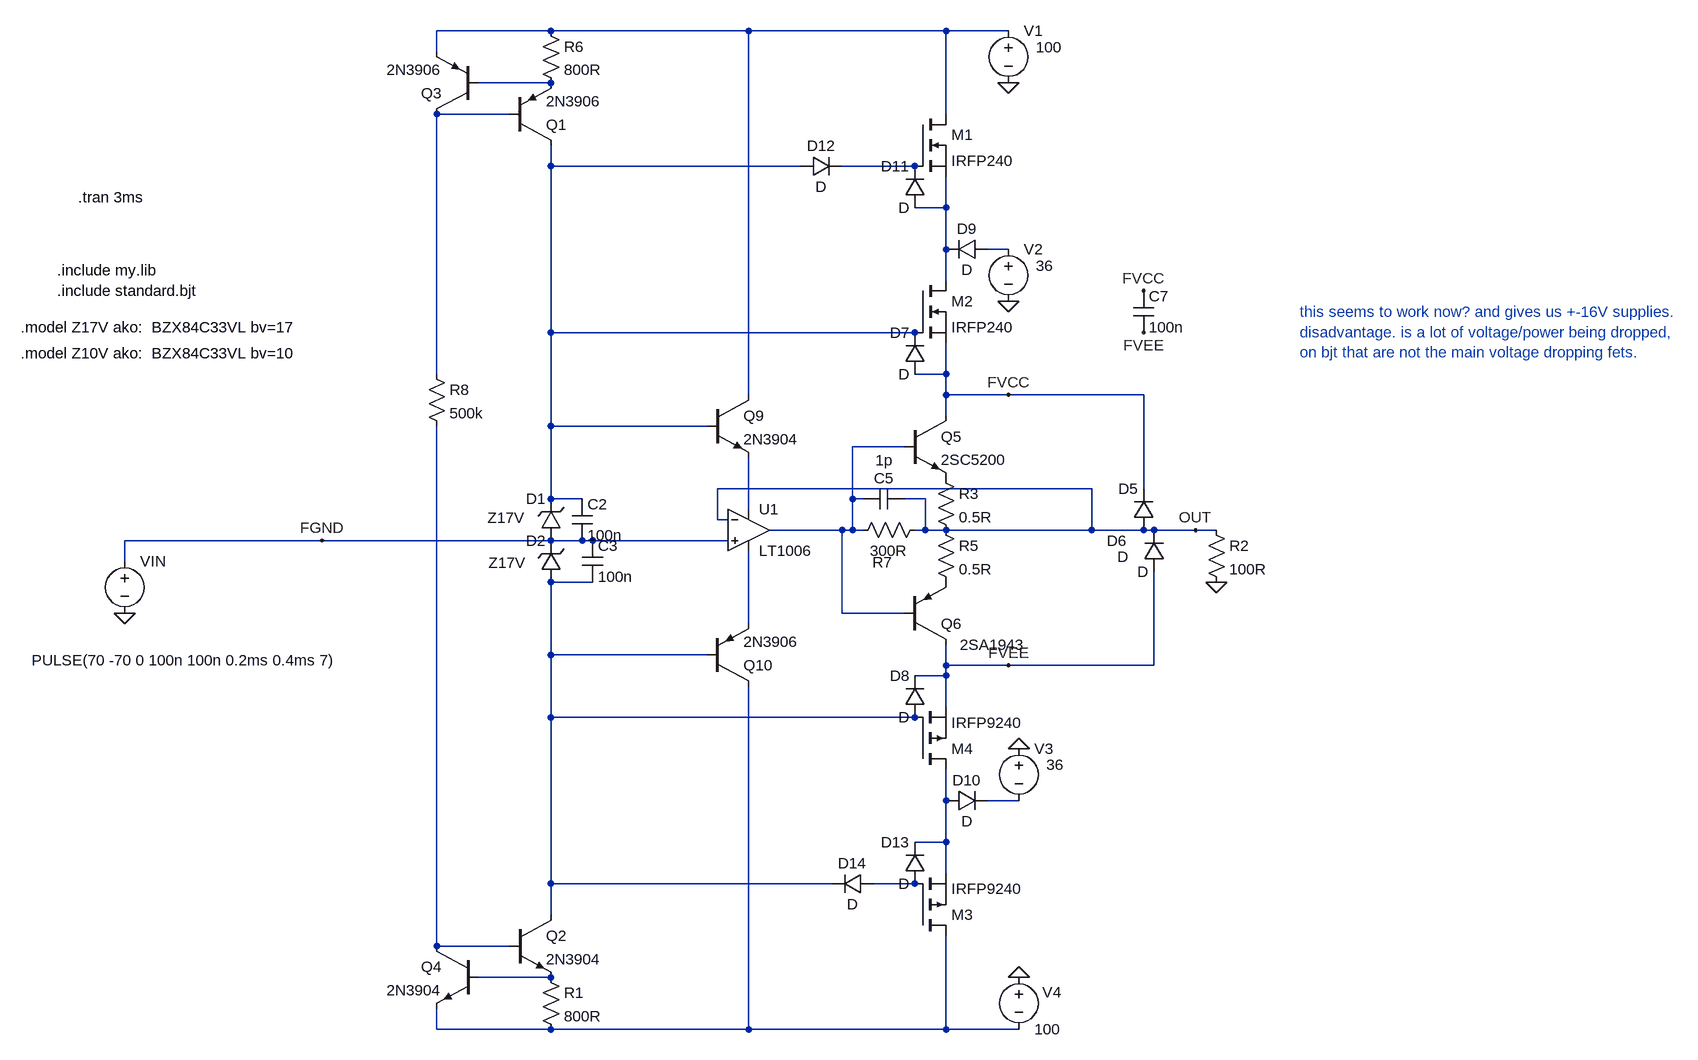
[diagram p0: schematic Draft10.asc]
Draft10.asc, the LTspice schematic file:
Version 4
SHEET 1 3300 1052
WIRE 624 -544 448 -544
WIRE 928 -544 624 -544
WIRE 1232 -544 928 -544
WIRE 1328 -544 1232 -544
WIRE 448 -512 448 -544
WIRE 624 -464 512 -464
WIRE 560 -416 448 -416
WIRE 1232 -416 1232 -544
WIRE 624 -336 624 -368
WIRE 1008 -336 624 -336
WIRE 1184 -336 1072 -336
WIRE 1232 -272 1232 -320
WIRE 1232 -272 1184 -272
WIRE 1232 -208 1232 -272
WIRE 1328 -208 1296 -208
WIRE 1232 -160 1232 -208
WIRE 624 -80 624 -336
WIRE 1184 -80 624 -80
WIRE 448 -16 448 -416
WIRE 1232 -16 1232 -64
WIRE 1232 -16 1184 -16
WIRE 928 16 928 -544
WIRE 1232 16 1232 -16
WIRE 1328 16 1232 16
WIRE 1536 16 1328 16
WIRE 1232 48 1232 16
WIRE 624 64 624 -80
WIRE 864 64 624 64
WIRE 1168 96 1088 96
WIRE 1456 160 880 160
WIRE 1536 160 1536 16
WIRE 624 176 624 64
WIRE 672 176 624 176
WIRE 1088 176 1088 96
WIRE 1104 176 1088 176
WIRE 1200 176 1168 176
WIRE 928 192 928 112
WIRE 880 208 880 160
WIRE 896 208 880 208
WIRE 1072 224 960 224
WIRE 1088 224 1088 176
WIRE 1088 224 1072 224
WIRE 1104 224 1088 224
WIRE 1200 224 1200 176
WIRE 1200 224 1184 224
WIRE 1232 224 1200 224
WIRE 1456 224 1456 160
WIRE 1456 224 1232 224
WIRE 1536 224 1456 224
WIRE 1552 224 1536 224
WIRE 1616 224 1552 224
WIRE 1648 224 1616 224
WIRE 272 240 -32 240
WIRE 624 240 272 240
WIRE 672 240 624 240
WIRE 688 240 672 240
WIRE 896 240 688 240
WIRE -32 272 -32 240
WIRE 688 304 624 304
WIRE 1072 352 1072 224
WIRE 1168 352 1072 352
WIRE 928 368 928 256
WIRE 624 416 624 304
WIRE 864 416 624 416
WIRE 1232 432 1232 400
WIRE 1328 432 1232 432
WIRE 1552 432 1552 288
WIRE 1552 432 1328 432
WIRE 1232 448 1232 432
WIRE 1232 448 1184 448
WIRE 1232 496 1232 448
WIRE 624 512 624 416
WIRE 1184 512 624 512
WIRE 1232 640 1232 592
WIRE 1344 640 1296 640
WIRE 1232 704 1232 640
WIRE 1232 704 1184 704
WIRE 1232 752 1232 704
WIRE 624 768 624 512
WIRE 1056 768 624 768
WIRE 1184 768 1120 768
WIRE 624 816 624 768
WIRE 448 864 448 64
WIRE 560 864 448 864
WIRE 624 912 512 912
WIRE 448 992 448 960
WIRE 624 992 448 992
WIRE 928 992 928 464
WIRE 928 992 624 992
WIRE 1232 992 1232 848
WIRE 1232 992 928 992
WIRE 1344 992 1232 992
FLAG -32 352 0
FLAG 1328 -464 0
FLAG 1648 304 0
FLAG 1328 16 FVCC
FLAG 1328 432 FVEE
FLAG 272 240 FGND
FLAG 1536 -144 FVCC
FLAG 1536 -80 FVEE
FLAG 1328 -128 0
FLAG 1344 560 0
FLAG 1344 912 0
FLAG 1616 224 OUT
SYMBOL voltage -32 256 R0
WINDOW 123 0 0 Left 0
WINDOW 39 0 0 Left 0
WINDOW 3 -143 168 Left 2
SYMATTR Value PULSE(70 -70 0 100n 100n 0.2ms 0.4ms 7)
SYMATTR InstName VIN
SYMBOL pnp 560 -368 M180
SYMATTR InstName Q1
SYMATTR Value 2N3906
SYMBOL pnp 512 -416 R180
SYMATTR InstName Q3
SYMATTR Value 2N3906
SYMBOL res 608 -560 R0
SYMATTR InstName R6
SYMATTR Value 800R
SYMBOL voltage 1328 -560 R0
WINDOW 123 0 0 Left 0
WINDOW 39 0 0 Left 0
WINDOW 3 42 41 Left 2
SYMATTR Value 100
SYMATTR InstName V1
SYMBOL voltage 1344 896 R0
WINDOW 123 0 0 Left 0
WINDOW 39 0 0 Left 0
WINDOW 0 36 39 Left 2
SYMATTR InstName V4
SYMATTR Value 100
SYMBOL res 432 -32 R0
SYMATTR InstName R8
SYMATTR Value 500k
SYMBOL zener 640 240 R180
WINDOW 0 24 64 Left 2
WINDOW 3 56 35 Left 2
SYMATTR InstName D1
SYMATTR Value Z17V
SYMBOL zener 640 304 R180
WINDOW 0 24 64 Left 2
WINDOW 3 54 30 Left 2
SYMATTR InstName D2
SYMATTR Value Z17V
SYMBOL npn 560 816 R0
SYMATTR InstName Q2
SYMATTR Value 2N3904
SYMBOL res 608 896 R0
SYMATTR InstName R1
SYMATTR Value 800R
SYMBOL npn 512 864 M0
SYMATTR InstName Q4
SYMATTR Value 2N3904
SYMBOL npn 1168 48 R0
SYMATTR InstName Q5
SYMATTR Value 2SC5200
SYMBOL pnp 1168 400 M180
WINDOW 3 85 0 Left 2
SYMATTR Value 2SA1943
SYMATTR InstName Q6
SYMBOL res 1216 128 R0
SYMATTR InstName R3
SYMATTR Value 0.5R
SYMBOL res 1216 208 R0
SYMATTR InstName R5
SYMATTR Value 0.5R
SYMBOL res 1200 208 R90
WINDOW 0 81 66 VBottom 2
WINDOW 3 32 56 VTop 2
SYMATTR InstName R7
SYMATTR Value 300R
SYMBOL nmos 1184 -160 R0
SYMATTR InstName M2
SYMATTR Value IRFP240
SYMBOL pmos 1184 592 M180
SYMATTR InstName M4
SYMATTR Value IRFP9240
SYMBOL OpAmps\\LT1006 928 160 R0
SYMATTR InstName U1
SYMBOL cap 656 176 R0
SYMATTR InstName C2
SYMATTR Value 100n
SYMBOL cap 672 240 R0
SYMATTR InstName C3
SYMATTR Value 100n
SYMBOL cap 1168 160 R90
WINDOW 0 0 32 VBottom 2
WINDOW 3 -59 31 VTop 2
SYMATTR InstName C5
SYMATTR Value 1p
SYMBOL res 1632 208 R0
SYMATTR InstName R2
SYMATTR Value 100R
SYMBOL cap 1520 -144 R0
SYMATTR InstName C7
SYMATTR Value 100n
SYMBOL diode 1552 224 R180
WINDOW 0 24 64 Left 2
WINDOW 3 39 -41 Left 2
SYMATTR InstName D5
SYMBOL diode 1568 288 R180
WINDOW 0 58 48 Left 2
WINDOW 3 24 0 Left 2
SYMATTR InstName D6
SYMBOL diode 1200 -16 R180
WINDOW 0 24 64 Left 2
WINDOW 3 24 0 Left 2
SYMATTR InstName D7
SYMBOL diode 1200 512 R180
WINDOW 0 24 64 Left 2
WINDOW 3 24 0 Left 2
SYMATTR InstName D8
SYMBOL diode 1296 -224 R90
WINDOW 0 0 32 VBottom 2
WINDOW 3 32 32 VTop 2
SYMATTR InstName D9
SYMBOL voltage 1328 -224 R0
WINDOW 123 0 0 Left 0
WINDOW 39 0 0 Left 0
WINDOW 3 42 41 Left 2
SYMATTR Value 36
SYMATTR InstName V2
SYMBOL diode 1232 656 R270
WINDOW 0 32 32 VTop 2
WINDOW 3 0 32 VBottom 2
SYMATTR InstName D10
SYMBOL voltage 1344 544 R0
WINDOW 123 0 0 Left 0
WINDOW 39 0 0 Left 0
WINDOW 3 42 41 Left 2
SYMATTR Value 36
SYMATTR InstName V3
SYMBOL nmos 1184 -416 R0
SYMATTR InstName M1
SYMATTR Value IRFP240
SYMBOL diode 1200 -272 R180
WINDOW 0 24 64 Left 2
WINDOW 3 24 0 Left 2
SYMATTR InstName D11
SYMBOL diode 1008 -320 R270
WINDOW 0 32 32 VTop 2
WINDOW 3 0 32 VBottom 2
SYMATTR InstName D12
SYMBOL pmos 1184 848 M180
SYMATTR InstName M3
SYMATTR Value IRFP9240
SYMBOL diode 1200 768 R180
WINDOW 0 24 64 Left 2
WINDOW 3 24 0 Left 2
SYMATTR InstName D13
SYMBOL diode 1120 752 R90
WINDOW 0 0 32 VBottom 2
WINDOW 3 32 32 VTop 2
SYMATTR InstName D14
SYMBOL npn 864 16 R0
SYMATTR InstName Q9
SYMATTR Value 2N3904
SYMBOL pnp 864 464 M180
SYMATTR InstName Q10
SYMATTR Value 2N3906
TEXT -104 -288 Left 2 !.tran 3ms
TEXT -136 -176 Left 2 !.include my.lib
TEXT -192 -88 Left 2 !.model Z17V ako:  BZX84C33VL bv=17
TEXT -192 -48 Left 2 !.model Z10V ako:  BZX84C33VL bv=10
TEXT -136 -144 Left 2 !.include standard.bjt
TEXT 1776 -112 Left 2 ;this seems to work now? and gives us +-16V supplies.\ndisadvantage. is a lot of voltage/power being dropped,\non bjt that are not the main voltage dropping fets.

The netlist it stands for:
* Draft10.asc
VIN FGND 0 PULSE(70 -70 0 100n 100n 0.2ms 0.4ms 7)
Q1 N004 N003 N002 0 2N3906
Q3 N003 N002 N001 0 2N3906
R6 N001 N002 800R
V1 N001 0 100
V4 0 N017 100
R8 N003 N015 500k
D1 FGND N004 Z17V
D2 N010 FGND Z17V
Q2 N010 N015 N016 0 2N3904
R1 N016 N017 800R
Q4 N015 N016 N017 0 2N3904
Q5 FVCC N008 P001 0 2SC5200
Q6 FVEE N008 P002 0 2SA1943
R3 P001 OUT 0.5R
R5 OUT P002 0.5R
R7 OUT N008 300R
M2 N006 N004 FVCC FVCC IRFP240
M4 N012 N010 FVEE FVEE IRFP9240
XU1 FGND OUT N009 N011 N008 LT1006  ; pins In+ In- V+ V- OUT
C2 N004 FGND 100n
C3 FGND N010 100n
C5 OUT N008 1p
R2 OUT 0 100R
C7 FVCC FVEE 100n
D5 OUT FVCC D
D6 FVEE OUT D
D7 FVCC N004 D
D8 N010 FVEE D
D9 N007 N006 D
V2 N007 0 36
D10 N012 N013 D
V3 0 N013 36
M1 N001 N005 N006 N006 IRFP240
D11 N006 N005 D
D12 N004 N005 D
M3 N017 N014 N012 N012 IRFP9240
D13 N014 N012 D
D14 N014 N010 D
Q9 N001 N004 N009 0 2N3904
Q10 N017 N010 N011 0 2N3906
.model D D
.lib standard.dio
.model NPN NPN
.model PNP PNP
.lib standard.bjt
.model NMOS NMOS
.model PMOS PMOS
.lib standard.mos
.tran 3ms
.include my.lib
.model Z17V ako:  BZX84C33VL bv=17
.model Z10V ako:  BZX84C33VL bv=10
.include standard.bjt
* this seems to work now? and gives us +-16V supplies.
* disadvantage. is a lot of voltage/power being dropped,
* on bjt that are not the main voltage dropping fets.
.lib LTC.lib
.backanno
.end